# EAGLE design mother3 (EAGLE 8.3.1)
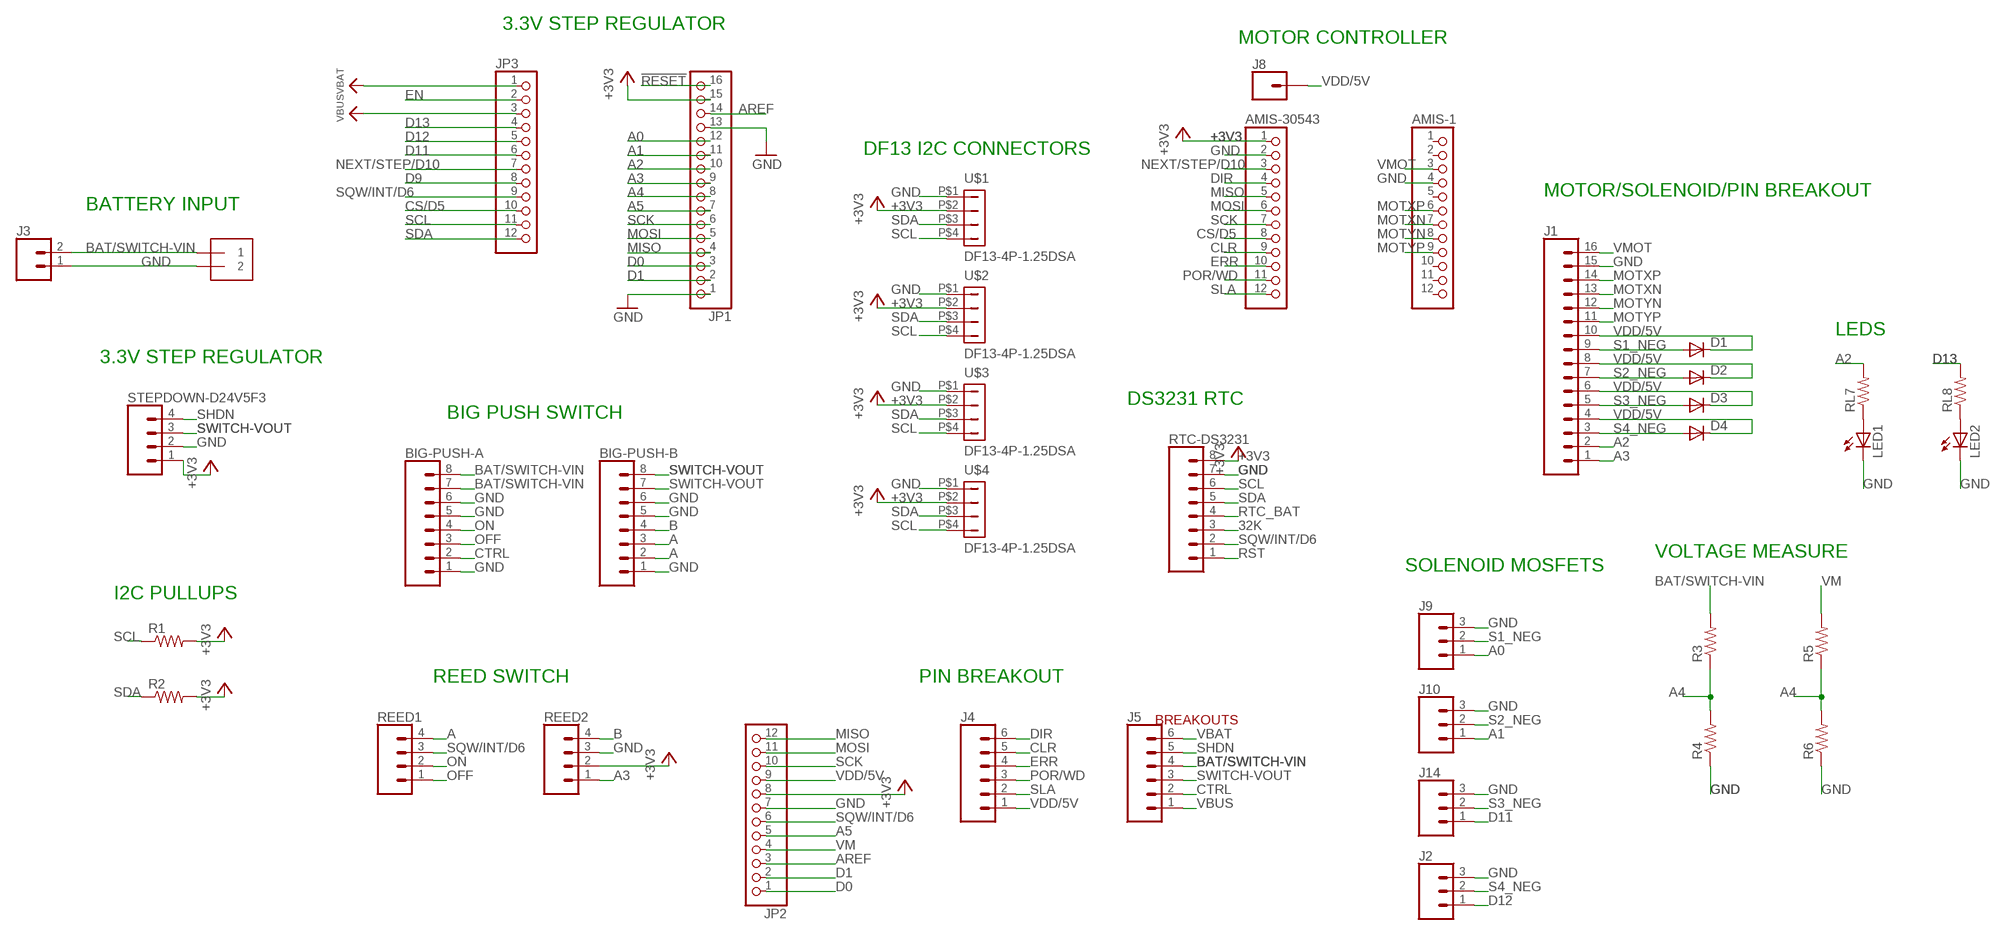
[diagram p0: schematic, sheet 1]

## Parts
AMIS-1  PINHD-1X12-CB  [1X12-CB]
AMIS-30543  PINHD-1X12-CB  [1X12-CB]
BAT  1X2-3.5MM  [1X2-3.5MM]
BIG-PUSH-A  CONN_08"  [1X08]
BIG-PUSH-B  CONN_08"  [1X08]
D1  1N4148DO35-7  [DO35-7]
D2  1N4148DO35-7  [DO35-7]
D3  1N4148DO35-7  [DO35-7]
D4  1N4148DO35-7  [DO35-7]
J1  CONN_16  [1X16]
J2  CONN_03  [1X03]
J3  CONN_02  [1X02]
J4  CONN_06SILK_FEMALE_PTH  [1X06]
J5  CONN_06SILK_FEMALE_PTH  [1X06]
J8  CONN_01  [1X01]
J9  CONN_03  [1X03]
J10  CONN_03  [1X03]
J14  CONN_03  [1X03]
JP1  HEADER-1X16ROUND  [1X16_ROUND]
JP2  HEADER-1X12  [1X12_ROUND]
JP3  HEADER-1X12  [1X12_ROUND]
LED1  LED5MM  [LED5MM]
LED2  LED5MM  [LED5MM]
R1  R-US_0207/10  [0207/10]
R2  R-US_0207/10  [0207/10]
R3  R-US_0207/10  [0207/10]
R4  R-US_0207/10  [0207/10]
R5  R-US_0207/10  [0207/10]
R6  R-US_0207/10  [0207/10]
REED1  CONN_04  [1X04]
REED2  CONN_04  [1X04]
RL7  R-US_0207/10  [0207/10]
RL8  R-US_0207/10  [0207/10]
RTC-DS3231  CONN_08"  [1X08]
STEPDOWN-D24V5F3  CONN_04  [1X04]
U$1  DF13-4P-1.25DSA  [DF13-4P-1.25DSA]
U$2  DF13-4P-1.25DSA  [DF13-4P-1.25DSA]
U$3  DF13-4P-1.25DSA  [DF13-4P-1.25DSA]
U$4  DF13-4P-1.25DSA  [DF13-4P-1.25DSA]

## Nets
32K: RTC-DS3231.3
!RESET: JP1.16
+3V3: AMIS-30543.1 JP1.15 JP2.8 R1.2 R2.2 REED2.2 RTC-DS3231.8 STEPDOWN-D24V5F3.1 U$1.P$2 U$2.P$2 U$3.P$2 U$4.P$2
A: BIG-PUSH-B.2 BIG-PUSH-B.3 REED1.4
A0: J9.1 JP1.12
A1: J10.1 JP1.11
A2: J1.2 JP1.10 RL7.2
A3: J1.1 JP1.9 REED2.1
A4: JP1.8 R3.1 R4.2 R5.1 R6.2
A5: JP1.7 JP2.5
AREF: JP1.14 JP2.3
B: BIG-PUSH-B.4 REED2.4
BAT/SWITCH-VIN: BAT.1 BIG-PUSH-A.7 BIG-PUSH-A.8 J3.2 J5.4 R3.2
CLR: AMIS-30543.9 J4.5
CS/D5: AMIS-30543.8 JP3.10
CTRL: BIG-PUSH-A.2 J5.2
D0: JP1.3 JP2.1
D1: JP1.2 JP2.2
D9: JP3.8
D11: J14.1 JP3.6
D12: J2.1 JP3.5
D13: JP3.4 RL8.2
DIR: AMIS-30543.4 J4.6
EN: JP3.2
ERR: AMIS-30543.10 J4.4
GND: AMIS-1.4 AMIS-30543.2 BAT.2 BIG-PUSH-A.1 BIG-PUSH-A.5 BIG-PUSH-A.6 BIG-PUSH-B.1 BIG-PUSH-B.5 BIG-PUSH-B.6 J1.15 J2.3 J3.1 J9.3 J10.3 J14.3 JP1.1 JP1.13 JP2.7 LED1.K(C) LED2.K(C) R4.1 R6.1 REED2.3 RTC-DS3231.7 STEPDOWN-D24V5F3.2 U$1.P$1 U$2.P$1 U$3.P$1 U$4.P$1
MISO: AMIS-30543.5 JP1.4 JP2.12
MOSI: AMIS-30543.6 JP1.5 JP2.11
MOTXN: AMIS-1.7 J1.13
MOTXP: AMIS-1.6 J1.14
MOTYN: AMIS-1.8 J1.12
MOTYP: AMIS-1.9 J1.11
N$1: LED1.A RL7.1
N$2: LED2.A RL8.1
NEXT/STEP/D10: AMIS-30543.3 JP3.7
OFF: BIG-PUSH-A.3 REED1.1
ON: BIG-PUSH-A.4 REED1.2
POR/WD: AMIS-30543.11 J4.3
RST: RTC-DS3231.1
RTC_BAT: RTC-DS3231.4
S1_NEG: D1.A J1.9 J9.2
S2_NEG: D2.A J1.7 J10.2
S3_NEG: D3.A J1.5 J14.2
S4_NEG: D4.A J1.3 J2.2
SCK: AMIS-30543.7 JP1.6 JP2.10
SCL: JP3.11 R1.1 RTC-DS3231.6 U$1.P$4 U$2.P$4 U$3.P$4 U$4.P$4
SDA: JP3.12 R2.1 RTC-DS3231.5 U$1.P$3 U$2.P$3 U$3.P$3 U$4.P$3
SHDN: J5.5 STEPDOWN-D24V5F3.4
SLA: AMIS-30543.12 J4.2
SQW/INT/D6: JP2.6 JP3.9 REED1.3 RTC-DS3231.2
SWITCH-VOUT: BIG-PUSH-B.7 BIG-PUSH-B.8 J5.3 STEPDOWN-D24V5F3.3
VBAT: J5.6 JP3.1
VBUS: J5.1 JP3.3
VDD/5V: D1.C D2.C D3.C D4.C J1.4 J1.6 J1.8 J1.10 J4.1 J8.1 JP2.9
VM: JP2.4 R5.2
VMOT: AMIS-1.3 J1.16
Unconnected: AMIS-1.1 AMIS-1.2 AMIS-1.5 AMIS-1.10 AMIS-1.11 AMIS-1.12

## Notes on the sheet
- 3.3V STEP REGULATOR
- MOTOR CONTROLLER
- DF13 I2C CONNECTORS
- MOTOR/SOLENOID/PIN BREAKOUT
- BATTERY INPUT
- LEDS
- 3.3V STEP REGULATOR
- DS3231 RTC
- BIG PUSH SWITCH
- VOLTAGE MEASURE
- SOLENOID MOSFETS
- I2C PULLUPS
- REED SWITCH | PIN BREAKOUT
- BREAKOUTS

## Library data of the parts
AMIS-1 AMIS-30543 = adafruit:PINHD-1X12: PIN HEADER
BAT = adafruit:1X2: 3.5mm Terminal block http://www.ladyada.net/library/pcb/eaglelibrary.html
BIG-PUSH-A BIG-PUSH-B RTC-DS3231 = SparkFun-Connectors:CONN_08: Multi connection point. Often used as Generic Header-pin footprint for 0.1 inch spaced/style header connections On any of the 0.1 inch spaced packages, you can populate with these: Break Away Headers - Straight <https://www.sparkfun.com/products/116> (PRT-00116) Break Away Male Headers - Right Angle <https://www.sparkfun.com/products/553> (PRT-00553) Female Headers <https://www.sparkfun.com/products/115> (PRT-00115) Break Away Headers - Machine Pin <https://www.sparkfun.com/products/117> (PRT-00117) Break Away Female Headers - Swiss Machine Pin <https://www.sparkfun.com/products/743> (PRT-00743) Arduino Stackable Header - 8 Pin <https://www.sparkfun.com/products/9279> (PRT-09279) For SCREWTERMINALS and SPRING TERMINALS visit here: Screw Terimnals on SparkFun.com <https://www.sparkfun.com/search/results?term=Screw+Terminals> (5mm/3.5mm/2.54mm spacing) This device is also useful as a general connection point to wire up your design to another part of your project. Our various solder wires solder well into these plated through hole pads. Hook-Up Wire - Assortment (Stranded, 22 AWG) <https://www.sparkfun.com/products/11375> (PRT-11375) Hook-Up Wire - Assortment (Solid Core, 22 AWG) <https://www.sparkfun.com/products/11367> (PRT-11367) View the entire wire category on our website here <https://www.sparkfun.com/categories/141> Special notes: Molex polarized connector foot print use with SKU : PRT-08231 with associated crimp pins and housings. 1MM SMD Version SKU: PRT-10208 NOTES ON THE VARIANTS LOCK and LOCK_LONGPADS... This footprint was designed to help hold the alignment of a through-hole component (i.e. 6-pin header) while soldering it into place. You may notice that each hole has been shifted either up or down by 0.005 of an inch from it's more standard position (which is a perfectly straight line). This slight alteration caused the pins (the squares in the middle) to touch the edges of the holes. Because they are alternating, it causes a "brace" to hold the component in place. 0.005 has proven to be the perfect amount of "off-center" position when using our standard breakaway headers. Although looks a little odd when you look at the bare footprint, once you have a header in there, the alteration is very hard to notice. Also,if you push a header all the way into place, it is covered up entirely on the bottom side.; PROD_ID: CONN-08438
D1-D4 = diode:1N4148: DIODE high speed (Philips)
J1 = SparkFun-Connectors:CONN_16: Multi connection point. Often used as Generic Header-pin footprint for 0.1 inch spaced/style header connections On any of the 0.1 inch spaced packages, you can populate with these: Break Away Headers - Straight <https://www.sparkfun.com/products/116> (PRT-00116) Break Away Male Headers - Right Angle <https://www.sparkfun.com/products/553> (PRT-00553) Female Headers <https://www.sparkfun.com/products/115> (PRT-00115) Break Away Headers - Machine Pin <https://www.sparkfun.com/products/117> (PRT-00117) Break Away Female Headers - Swiss Machine Pin <https://www.sparkfun.com/products/743> (PRT-00743) For SCREWTERMINALS and SPRING TERMINALS visit here: Screw Terimnals on SparkFun.com <https://www.sparkfun.com/search/results?term=Screw+Terminals> (5mm/3.5mm/2.54mm spacing) This device is also useful as a general connection point to wire up your design to another part of your project. Our various solder wires solder well into these plated through hole pads. Hook-Up Wire - Assortment (Stranded, 22 AWG) <https://www.sparkfun.com/products/11375> (PRT-11375) Hook-Up Wire - Assortment (Solid Core, 22 AWG) <https://www.sparkfun.com/products/11367> (PRT-11367) View the entire wire category on our website here <https://www.sparkfun.com/categories/141> Special notes: Molex polarized connector foot print use with SKU : PRT-08231 with associated crimp pins and housings. 1MM SMD Version SKU: PRT-10208 NOTES ON THE VARIANTS LOCK and LOCK_LONGPADS... This footprint was designed to help hold the alignment of a through-hole component (i.e. 6-pin header) while soldering it into place. You may notice that each hole has been shifted either up or down by 0.005 of an inch from it's more standard position (which is a perfectly straight line). This slight alteration caused the pins (the squares in the middle) to touch the edges of the holes. Because they are alternating, it causes a "brace" to hold the component in place. 0.005 has proven to be the perfect amount of "off-center" position when using our standard breakaway headers. Although looks a little odd when you look at the bare footprint, once you have a header in there, the alteration is very hard to notice. Also,if you push a header all the way into place, it is covered up entirely on the bottom side.
J2 J9 J10 J14 = SparkFun-Connectors:CONN_03: Multi connection point. Often used as Generic Header-pin footprint for 0.1 inch spaced/style header connections On any of the 0.1 inch spaced packages, you can populate with these: Break Away Headers - Straight <https://www.sparkfun.com/products/116> (PRT-00116) Break Away Male Headers - Right Angle <https://www.sparkfun.com/products/553> (PRT-00553) Female Headers <https://www.sparkfun.com/products/115> (PRT-00115) Break Away Headers - Machine Pin <https://www.sparkfun.com/products/117> (PRT-00117) Break Away Female Headers - Swiss Machine Pin <https://www.sparkfun.com/products/743> (PRT-00743) Stackable Header - 3 Pin (Female, 0.1") <https://www.sparkfun.com/products/13875> (PRT-13875) For SCREWTERMINALS and SPRING TERMINALS visit here: Screw Terimnals on SparkFun.com <https://www.sparkfun.com/search/results?term=Screw+Terminals> (5mm/3.5mm/2.54mm spacing) This device is also useful as a general connection point to wire up your design to another part of your project. Our various solder wires solder well into these plated through hole pads. Hook-Up Wire - Assortment (Stranded, 22 AWG) <https://www.sparkfun.com/products/11375> (PRT-11375) Hook-Up Wire - Assortment (Solid Core, 22 AWG) <https://www.sparkfun.com/products/11367> (PRT-11367) View the entire wire category on our website here <https://www.sparkfun.com/categories/141> Special notes: Molex polarized connector foot print use with SKU : PRT-08232 with associated crimp pins and housings.
J3 = SparkFun-Connectors:CONN_02: Multi connection point. Often used as Generic Header-pin footprint for 0.1 inch spaced/style header connections On any of the 0.1 inch spaced packages, you can populate with these: Break Away Headers - Straight <https://www.sparkfun.com/products/116> (PRT-00116) Break Away Male Headers - Right Angle <https://www.sparkfun.com/products/553> (PRT-00553) Female Headers <https://www.sparkfun.com/products/115> (PRT-00115) Break Away Headers - Machine Pin <https://www.sparkfun.com/products/117> (PRT-00117) Break Away Female Headers - Swiss Machine Pin <https://www.sparkfun.com/products/743> (PRT-00743) For SCREWTERMINALS and SPRING TERMINALS visit here: Screw Terimnals on SparkFun.com <https://www.sparkfun.com/search/results?term=Screw+Terminals> (5mm/3.5mm/2.54mm spacing) This device is also useful as a general connection point to wire up your design to another part of your project. Our various solder wires solder well into these plated through hole pads. Hook-Up Wire - Assortment (Stranded, 22 AWG) <https://www.sparkfun.com/products/11375> (PRT-11375) Hook-Up Wire - Assortment (Solid Core, 22 AWG) <https://www.sparkfun.com/products/11367> (PRT-11367) View the entire wire category on our website here <https://www.sparkfun.com/categories/141> Special notes: Molex polarized connector foot print use with: PRT-08233 with associated crimp pins and housings. 2.54_SCREWTERM for use with PRT-10571. 3.5mm Screw Terminal footprints for PRT-08084 5mm Screw Terminal footprints for use with PRT-08432
J4 J5 = SparkFun-Connectors:CONN_06: Multi connection point. Often used as Generic Header-pin footprint for 0.1 inch spaced/style header connections On any of the 0.1 inch spaced packages, you can populate with these: Break Away Headers - Straight <https://www.sparkfun.com/products/116> (PRT-00116) Break Away Male Headers - Right Angle <https://www.sparkfun.com/products/553> (PRT-00553) Female Headers <https://www.sparkfun.com/products/115> (PRT-00115) Break Away Headers - Machine Pin <https://www.sparkfun.com/products/117> (PRT-00117) Break Away Female Headers - Swiss Machine Pin <https://www.sparkfun.com/products/743> (PRT-00743) Arduino Stackable Header - 6 Pin <https://www.sparkfun.com/products/9280> (PRT-09280) For SCREWTERMINALS and SPRING TERMINALS visit here: Screw Terimnals on SparkFun.com <https://www.sparkfun.com/search/results?term=Screw+Terminals> (5mm/3.5mm/2.54mm spacing) This device is also useful as a general connection point to wire up your design to another part of your project. Our various solder wires solder well into these plated through hole pads. Hook-Up Wire - Assortment (Stranded, 22 AWG) <https://www.sparkfun.com/products/11375> (PRT-11375) Hook-Up Wire - Assortment (Solid Core, 22 AWG) <https://www.sparkfun.com/products/11367> (PRT-11367) View the entire wire category on our website here <https://www.sparkfun.com/categories/141>; PROD_ID: CONN-08437
J8 = SparkFun-Connectors:CONN_01: Single connection point. Often used as Generic Header-pin footprint for 0.1 inch spaced/style header connections On any of the 0.1 inch spaced packages, you can populate with these: Break Away Headers - Straight <https://www.sparkfun.com/products/116> (PRT-00116) Break Away Male Headers - Right Angle <https://www.sparkfun.com/products/553> (PRT-00553) Female Headers <https://www.sparkfun.com/products/115> (PRT-00115) Break Away Headers - Machine Pin <https://www.sparkfun.com/products/117> (PRT-00117) Break Away Female Headers - Swiss Machine Pin <https://www.sparkfun.com/products/743> (PRT-00743) This device is also useful as a general connection point to wire up your design to another part of your project. Our various solder wires solder well into these plated through hole pads. Hook-Up Wire - Assortment (Stranded, 22 AWG) <https://www.sparkfun.com/products/11375> (PRT-11375) Hook-Up Wire - Assortment (Solid Core, 22 AWG) <https://www.sparkfun.com/products/11367> (PRT-11367) View the entire wire category on our website here <https://www.sparkfun.com/categories/141> Special notes: SMTSO-256-ET is a "flush mount" nut for a 4-40 screw. We mostly use this on specialty testbeds; it is a nice way to connect hardware to your PCB at an adjustable hieght. Also note, the SNAP packages are for using a snappable style connector. We sell a baggie of snaps and they are also used on two LilyPad designs: Snap Assortment - 30 pack (male and female) <https://www.sparkfun.com/products/11347> (DEV-11347) LilyPad Arduino SimpleSnap <https://www.sparkfun.com/products/10941> (DEV-10941) LilyPad SimpleSnap Protoboard <https://www.sparkfun.com/products/10940> (DEV-10940)
JP1 = microbuilder:HEADER-1X16: PIN HEADER
JP2 JP3 = microbuilder:HEADER-1X12
LED1 LED2 = adafruit:LED: LED OSRAM: - CHIPLED LG R971, LG N971, LY N971, LG Q971, LY Q971, LO R971, LY R971 LH N974, LH R974 LS Q976, LO Q976, LY Q976 LO Q996 - Hyper CHIPLED LW Q18S LB Q993, LB Q99A, LB R99A - SideLED LS A670, LO A670, LY A670, LG A670, LP A670 LB A673, LV A673, LT A673, LW A673 LH A674 LY A675 LS A676, LA A676, LO A676, LY A676, LW A676 LS A679, LY A679, LG A679 - Hyper Micro SIDELED® LS Y876, LA Y876, LO Y876, LY Y876 LT Y87S - SmartLED LW L88C, LW L88S LB L89C, LB L89S, LG L890 LS L89K, LO L89K, LY L89K LS L896, LA L896, LO L896, LY L896 - TOPLED LS T670, LO T670, LY T670, LG T670, LP T670 LSG T670, LSP T670, LSY T670, LOP T670, LYG T670 LG T671, LOG T671, LSG T671 LB T673, LV T673, LT T673, LW T673 LH T674 LS T676, LA T676, LO T676, LY T676, LB T676, LH T676, LSB T676, LW T676 LB T67C, LV T67C, LT T67C, LS T67K, LO T67K, LY T67K, LW E67C LS E67B, LA E67B, LO E67B, LY E67B, LB E67C, LV E67C, LT E67C LW T67C LS T679, LY T679, LG T679 LS T770, LO T770, LY T770, LG T770, LP T770 LB T773, LV T773, LT T773, LW T773 LH T774 LS E675, LA E675, LY E675, LS T675 LS T776, LA T776, LO T776, LY T776, LB T776 LHGB T686 LT T68C, LB T68C - Hyper Mini TOPLED® LB M676 - Mini TOPLED Santana® LG M470 LS M47K, LO M47K, LY M47K Source: http://www.osram.convergy.de/
R1-R6 RL7 RL8 = adafruit:R-US_: RESISTOR, American symbol
REED1 REED2 STEPDOWN-D24V5F3 = SparkFun-Connectors:CONN_04: Multi connection point. Often used as Generic Header-pin footprint for 0.1 inch spaced/style header connections On any of the 0.1 inch spaced packages, you can populate with these: Break Away Headers - Straight <https://www.sparkfun.com/products/116> (PRT-00116) Break Away Male Headers - Right Angle <https://www.sparkfun.com/products/553> (PRT-00553) Female Headers <https://www.sparkfun.com/products/115> (PRT-00115) Break Away Headers - Machine Pin <https://www.sparkfun.com/products/117> (PRT-00117) Break Away Female Headers - Swiss Machine Pin <https://www.sparkfun.com/products/743> (PRT-00743) For SCREWTERMINALS and SPRING TERMINALS visit here: Screw Terimnals on SparkFun.com <https://www.sparkfun.com/search/results?term=Screw+Terminals> (5mm/3.5mm/2.54mm spacing) This device is also useful as a general connection point to wire up your design to another part of your project. Our various solder wires solder well into these plated through hole pads. Hook-Up Wire - Assortment (Stranded, 22 AWG) <https://www.sparkfun.com/products/11375> (PRT-11375) Hook-Up Wire - Assortment (Solid Core, 22 AWG) <https://www.sparkfun.com/products/11367> (PRT-11367) View the entire wire category on our website here <https://www.sparkfun.com/categories/141> Special notes: Molex polarized connector foot print use with SKU : PRT-08231 with associated crimp pins and housings. 1MM SMD Version SKU: PRT-10208; PROD_ID: CONN-09696
U$1-U$4 = con-hirose-df13:DF13-4P-1.25: DF13-4P 1.25mm Pitch Miniature Crimping Connector.

## Board
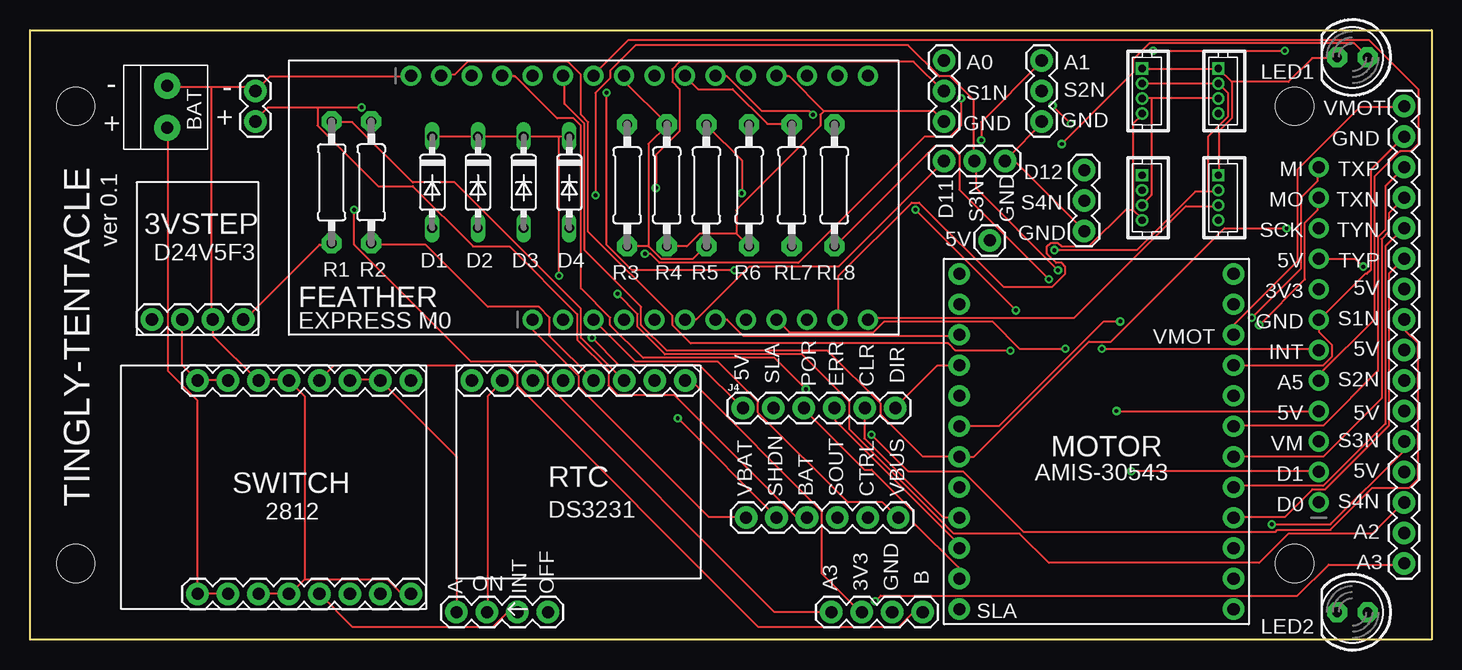
[diagram p1: board, top side]
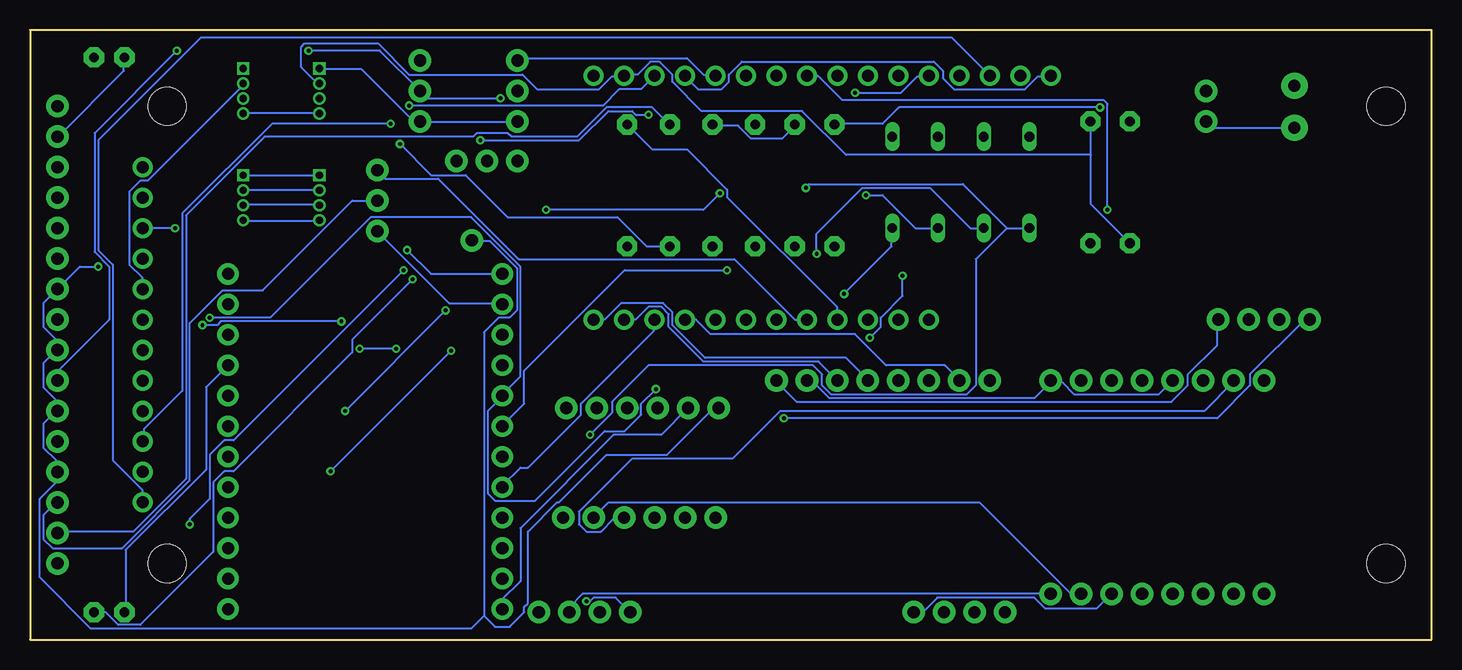
[diagram p2: board, bottom side, seen from below]

Size 116.84 x 50.8 mm. Coordinates in mm from the lower left corner, seen from the top.
Outline: 0,0 0,50.8 116.84,50.8 116.84,0 0,0
Copper layers (1*16): Top 0.0356mm / dielectric 1.5011mm / Bottom 0.0356mm
Design rules "LaenPCBOrder": minimum track width 6mil, minimum drill 13mil, track to track 6mil, track to pad 6mil, pad to pad 6mil, via to via 6mil, smd to smd 6mil, copper to edge 15mil, drill to drill 6mil, minimum pad ring 7mil, minimum via ring 7mil, stop-mask expansion 3mil, vias tented up to drill 0mil, thermal gap 10mil
Holes 3.17 mm at 3.81,44.45 3.81,6.35 105.41,44.45 105.41,6.35

### Footprints (pad centres in the part's own frame; a part is rotated, then mirrored left to right if it is on the bottom)
1X12-CB = drill 1.016 pad 1.778: 1 -13.97,0; 2 -11.43,0; 3 -8.89,0; 4 -6.35,0; 5 -3.81,0; 6 -1.27,0; 7 1.27,0; 8 3.81,0; 9 6.35,0; 10 8.89,0; 11 11.43,0; 12 13.97,0
1X2-3.5MM = drill 1 pad 2.184: 1 1.8,0; 2 -1.7,0
1X08 = drill 1.016 pad 1.88: 1 0,0; 2 2.54,0; 3 5.08,0; 4 7.62,0; 5 10.16,0; 6 12.7,0; 7 15.24,0; 8 17.78,0
DO35-7 = drill 0.813 long: A 3.81,0; C -3.81,0
1X16 = drill 1.016 pad 1.88: 1 0,0; 2 2.54,0; 3 5.08,0; 4 7.62,0; 5 10.16,0; 6 12.7,0; 7 15.24,0; 8 17.78,0; 9 20.32,0; 10 22.86,0; 11 25.4,0; 12 27.94,0; 13 30.48,0; 14 33.02,0; 15 35.56,0; 16 38.1,0
1X03 = drill 1.016 pad 1.88: 1 0,0; 2 2.54,0; 3 5.08,0
1X02 = drill 1.016 pad 1.88: 1 0,0; 2 2.54,0
1X06 = drill 1.016 pad 1.88: 1 0,0; 2 2.54,0; 3 5.08,0; 4 7.62,0; 5 10.16,0; 6 12.7,0
1X01 = drill 1.016 pad 1.88: 1 0,0
1X16_ROUND = drill 1 pad 1.676: 1 -19.05,0; 2 -16.51,0; 3 -13.97,0; 4 -11.43,0; 5 -8.89,0; 6 -6.35,0; 7 -3.81,0; 8 -1.27,0; 9 1.27,0; 10 3.81,0; 11 6.35,0; 12 8.89,0; 13 11.43,0; 14 13.97,0; 15 16.51,0; 16 19.05,0
1X12_ROUND = drill 1 pad 1.676: 1 -13.97,0; 2 -11.43,0; 3 -8.89,0; 4 -6.35,0; 5 -3.81,0; 6 -1.27,0; 7 1.27,0; 8 3.81,0; 9 6.35,0; 10 8.89,0; 11 11.43,0; 12 13.97,0
LED5MM = drill 0.813 pad 1.676 octagon: A -1.27,0; K 1.27,0
0207/10 = drill 0.813 pad 1.676 octagon: 1 -5.08,0; 2 5.08,0
1X04 = drill 1.016 pad 1.88: 1 0,0; 2 2.54,0; 3 5.08,0; 4 7.62,0
DF13-4P-1.25DSA = drill 0.6 pad 1.016 square: P$1 1.875,0 | drill 0.6 pad 1.016: P$2 0.625,0; P$3 -0.625,0; P$4 -1.875,0

### Placement (x,y rotation side)
AMIS-1  100.33,16.51 270 top
AMIS-30543  77.47,16.51 270 top
BAT  11.43,44.45 270 top
BIG-PUSH-A  31.75,3.81 180 top
BIG-PUSH-B  31.75,21.59 180 top
D1  33.53,38.1 270 top
D2  37.34,38.1 270 top
D3  41.15,38.1 270 top
D4  44.96,38.1 270 top
J1  114.55,6.35 90 top
J2  87.88,39.12 270 top
J3  18.8,45.72 270 top
J4  59.44,19.3 0 top
J5  72.39,10.16 180 top
J8  80.01,33.27 0 top
J9  76.2,48.26 270 top
J10  84.33,48.26 270 top
J14  76.2,39.88 0 top
JP1  50.8,46.99 0 top
JP2  107.44,25.4 90 top
JP3  55.88,26.67 0 top
LED1  110.24,48.51 180 top
LED2  110.24,2.29 180 top
R1  25.15,38.1 270 top
R2  28.45,38.1 90 top
R3  49.78,37.85 90 top
R4  53.09,37.85 90 top
R5  56.39,37.85 90 top
R6  59.94,37.85 90 top
REED1  43.18,2.29 180 top
REED2  66.8,2.29 0 top
RL7  63.5,37.85 90 top
RL8  67.06,37.85 90 top
RTC-DS3231  36.83,21.59 0 top
STEPDOWN-D24V5F3  17.78,26.67 180 top
U$1  92.71,36.83 90 top
U$2  92.71,45.72 90 top
U$3  99.06,36.83 90 top
U$4  99.06,45.72 90 top

### Tracks (layer width: path | path; a pad name or v marks a point on that pad's centre or on a via)
+3V3  (via drill 0.33)
  Top 0.152: v85.39,32.46 92.25,32.46 97.13,37.34 98.2,37.34 | 98.2,37.34 98.96,37.34 U$3.P$2 | U$2.P$2 98.96,46.33 U$4.P$2 99.11,46.33 99.87,45.57 99.87,43.59 98.2,41.91 98.2,37.34 | R1.2 25.04,32.92 24.13,32.92 17.88,26.67 STEPDOWN-D24V5F3.1 | RTC-DS3231.8 54.61,21.49 55.22,21.49 66.04,10.67 66.04,5.49 69.24,2.29 REED2.2
  Bottom 0.152: U$1.P$2 92.71,37.49 98.96,37.49 U$3.P$2 | AMIS-30543.1 83.41,30.48 v85.39,32.46 | U$2.P$2 92.71,46.48 93.02,46.48 94.23,47.7 94.23,49.38 93.93,49.68 87.83,49.68 85.24,47.09 75.79,47.09 74.57,45.87 69.39,45.87 68.33,46.94 67.41,46.94 JP1.15 67.26,47.09 66.19,47.09 65.13,48.16 64.36,48.16 63.3,47.09 63.3,46.48 60.86,44.04 52.48,44.04 48.82,40.39 28.4,40.39 | JP2.8 107.49,29.26 107.49,30.18 108.56,31.24 108.56,37.34 107.64,38.25 107.04,38.25 98.96,46.33 U$4.P$2 | 28.4,40.39 28.4,36.27 R1.2 | 28.4,40.39 28.4,43.13 R2.2 | STEPDOWN-D24V5F3.1 17.88,26.67 17.88,24.54 20.32,22.1 20.32,21.18 21.69,19.81 52.93,19.81 54.61,21.49 RTC-DS3231.8
A
  Top 0.152: BIG-PUSH-B.3 26.72,21.64 29.16,21.64 BIG-PUSH-B.2 35.56,15.24 REED1.4
A0
  Bottom 0.152: JP1.12 59.79,47.09 60.71,47.09 62.08,48.46 75.95,48.46 76.1,48.31 J9.1
A1  (via drill 0.33)
  Top 0.152: v65.28,43.74 64.97,44.04 61.01,44.04 58.12,46.94 57.2,46.94 JP1.11 | v79.3,41.6 79.3,43.13 84.33,48.16 J10.1
  Bottom 0.152: v65.28,43.74 66.34,43.74 66.65,44.04 68.63,44.04 71.07,41.6 v79.3,41.6
A2
  Top 0.152: RL7.2 63.45,42.98 61.47,42.98 58.57,45.87 55.68,45.87 54.61,46.94 JP1.10
  Bottom 0.152: J1.2 114.5,8.99 108.25,8.99 103.83,13.41 103.83,35.36 97.28,41.91 79.91,41.91 79.6,42.22 77.01,42.22 76.71,41.91 71.22,41.91 68.78,44.35 64.97,44.35 63.6,42.98 RL7.2
A3  (via drill 0.33)
  Top 0.152: v27.03,35.81 27.03,32.92 36.78,23.16 42.11,23.16 43.18,22.1 43.18,21.18 62.08,2.29 REED2.1 | v70.46,3.2 70.92,3.66 105.66,3.66 108.25,6.25 114.5,6.25 J1.1
  Bottom 0.152: v27.03,35.81 27.03,44.65 27.33,44.96 49.12,44.96 51.11,46.94 52.02,46.94 JP1.9 | v70.46,3.2 70.16,3.2 69.85,3.5 68.02,3.5 REED2.1
A4
  Top 0.152: 51.56,32.77 R3.1 | 51.56,32.77 52.63,31.7 55.22,31.7 56.29,32.77 R5.1 | JP1.8 49.58,46.94 49.58,46.48 53.09,42.98 R4.2 53.09,42.82 51.56,41.3 51.56,32.77
  Bottom 0.152: R6.2 59.94,42.82 57.81,42.82 56.74,41.76 54.15,41.76 53.09,42.82 R4.2
A5
  Top 0.152: JP2.5 107.49,21.64 107.49,22.1 112.06,26.67 112.06,38.56 114.2,40.69 115.11,40.69 115.72,41.3 115.72,45.87 111.61,49.99 49.89,49.99 46.99,47.09 JP1.7
AREF  (via drill 0.33)
  Top 0.152: v85.24,44.5 v86.77,42.98
  Bottom 0.152: v86.77,42.98 96.67,42.98 104.14,35.51 104.14,20.73 107.34,17.53 107.34,16.61 JP2.3 | v85.24,44.5 69.09,44.5 67.72,45.87 65.89,45.87 JP1.14
B
  Top 0.152: REED2.4 73.66,2.29 72.44,1.07 60.71,1.07 40.59,21.18 40.59,22.1 39.83,22.86 25.35,22.86 24.13,21.64 BIG-PUSH-B.4
BAT/SWITCH-VIN  (via drill 0.33)
  Top 0.152: BIG-PUSH-A.7 BIG-PUSH-A.8 13.92,3.81 13.92,19.96 11.48,22.4 11.48,42.52 BAT.1 | 23.98,44.35 19.86,44.35 18.8,43.28 J3.2 | 23.98,44.35 v27.63,44.35 | 23.98,44.35 23.98,42.82 29.01,37.8 31.9,37.8 36.93,32.77 39.98,32.77 45.62,27.13 45.62,24.99 48.21,22.4 48.21,21.18 48.97,20.42 53.7,20.42 63.91,10.21 64.67,10.21 J5.4
  Bottom 0.152: v27.63,44.35 44.4,44.35 45.77,42.98 49.73,42.98 R3.2 | BAT.1 11.48,42.67 18.34,42.67 18.8,43.13 J3.2
CLR
  Top 0.152: AMIS-30543.9 77.47,10.21 76.1,10.21 69.55,16.76 69.55,19.2 J4.5
CS/D5
  Bottom 0.152: JP3.10 64.82,26.67 64.82,25.76 70.92,19.66 70.92,18.75 75.34,14.33 75.95,14.33 77.47,12.8 AMIS-30543.8
CTRL
  Bottom 0.152: BIG-PUSH-A.2 30.07,3.81 37.69,11.43 68.63,11.43 69.85,10.21 J5.2
D0
  Bottom 0.152: JP1.3 39.98,50.14 102.62,50.14 111.15,41.6 111.15,32.46 109.93,31.24 109.93,14.94 107.49,12.5 107.49,11.43 JP2.1
D1  (via drill 0.33)
  Top 0.152: v81.74,24.08 77.16,24.08 76.56,24.69 55.07,24.69 53.54,26.21 53.54,26.98 46.53,33.98 46.53,43.13 45.92,43.74 45.92,47.09 44.86,48.16 36.47,48.16 35.41,47.09 34.34,47.09 JP1.2 | v91.8,14.02 107.34,14.02 JP2.2
  Bottom 0.152: v91.8,14.02 v81.74,24.08
D11
  Top 0.152: JP3.6 55.52,26.67 59.94,31.09 67.41,31.09 J14.1
D12
  Bottom 0.152: JP3.5 53.09,26.67 58.12,31.7 76.1,31.7 82.8,38.41 87.22,38.41 87.83,39.01 J2.1
D13
  Bottom 0.152: RL8.2 64.97,40.84 62.08,40.84 58.73,37.49 58.73,36.88 49.58,27.74 49.58,26.67 JP3.4
DIR
  Top 0.152: AMIS-30543.4 75.64,22.86 72.14,19.36 J4.6
ERR
  Top 0.152: AMIS-30543.10 77.47,7.92 67.11,18.29 67.11,19.2 J4.4
GND
  Top 0.152: BIG-PUSH-A.6 BIG-PUSH-A.5 21.69,3.81 22.91,5.03 | BIG-PUSH-A.1 30.99,3.81 29.77,5.03 22.91,5.03 | JP1.1 31.75,46.94 20.02,46.94 J3.1 18.49,46.02 15.14,46.02 | 15.14,46.02 11.48,46.02 BAT.2 | 15.14,46.02 15.14,26.67 STEPDOWN-D24V5F3.2 15.29,26.67 15.29,25.3 18.95,21.64 BIG-PUSH-B.6 19.1,21.64 21.54,21.64 BIG-PUSH-B.5 22.91,20.27 22.91,5.03 | 107.49,26.67 107.49,25.6 108.56,24.54 108.56,23.62 107.8,22.86 AMIS-1.4 | U$2.P$1 92.71,47.55 98.96,47.55 U$4.P$1 99.11,47.55 100.18,46.48 | 100.18,46.48 100.18,43.43 99.11,42.37 99.11,38.71 U$3.P$1 | 100.18,46.48 104.9,46.48 106.88,48.46 108.86,48.46 LED1.K | 81.58,40.23 84.33,42.98 J10.3 | 81.58,40.23 81.28,39.93 J14.3 81.58,40.23 | R4.1 54.76,32.77 55.83,33.83 58.88,33.83 | R6.1 58.88,33.83 | 66.19,44.04 63.3,46.94 62.23,46.94 JP1.13 | 66.19,44.04 75.34,44.04 J9.3 | 58.88,33.83 58.88,35.81 65.89,42.82 65.89,43.74 66.19,44.04 | 81.58,40.23 81.74,40.23 87.83,34.14 J2.3 | 107.49,26.67 111.3,30.48 111.45,30.48 111.76,30.79 111.76,39.17 114.5,41.91 J1.15 | 107.49,26.67 JP2.7
  Bottom 0.152: BIG-PUSH-A.1 70.76,3.81 71.83,2.74 71.83,2.29 REED2.3 | 31.75,21.49 30.84,21.49 29.77,20.42 22.76,20.42 BIG-PUSH-B.5 | 31.75,21.49 33.12,20.12 50.19,20.12 51.56,21.49 52.02,21.49 RTC-DS3231.7 | 31.75,21.49 BIG-PUSH-B.1 | AMIS-1.4 102.16,21.03 102.16,14.17 108.86,7.47 108.86,2.29 LED2.K | U$1.P$1 98.96,38.71 U$3.P$1 | LED1.K 109.02,48.46 109.02,47.4 114.5,41.91 J1.15 | J2.3 81.89,28.04 77.47,28.04 AMIS-30543.2 | J9.3 76.25,43.13 84.33,43.13 J10.3 84.33,43.28 84.94,43.28 89.2,47.55 92.71,47.55 U$2.P$1 | JP1.1 31.75,46.94 32.82,46.94 33.88,45.87 39.83,45.87 40.74,46.79 40.74,47.4 41.5,48.16 57.51,48.16 58.57,47.09 58.57,46.48 59.18,45.87 61.16,45.87 62.23,46.94 JP1.13
MISO  (via drill 0.33)
  Top 0.152: v64.67,20.88 62.08,23.47 51.11,23.47 48.36,26.21 48.36,26.82 45.92,29.26 45.92,42.82 45.31,43.43 43.94,43.43 40.44,46.94 39.37,46.94 JP1.4 | v101.85,26.82 105.97,30.94 105.97,36.88 107.34,38.25 107.34,39.32 JP2.12
  Bottom 0.152: v64.67,20.88 65.89,19.66 65.89,18.75 67.26,17.37 68.94,17.37 74.73,11.58 78.08,11.58 78.69,12.19 78.69,19.05 77.47,20.27 AMIS-30543.5 77.47,20.42 75.95,21.95 75.95,31.09 80.06,35.2 88.44,35.2 96.83,26.82 v101.85,26.82
MOSI  (via drill 0.33)
  Top 0.152: v48.06,45.57 48.06,32.92 50.19,30.79 v58.73,30.79 | v102.46,26.21 106.27,30.02 106.27,34.75 107.34,35.81 107.34,36.73 JP2.11 | v90.88,26.52 89.51,26.52 80.82,17.83 77.47,17.83 AMIS-30543.6
  Bottom 0.152: v48.06,45.57 44.25,45.57 42.88,46.94 41.96,46.94 JP1.5 | v58.73,30.79 67.26,30.79 75.64,22.4 75.64,19.66 77.47,17.83 AMIS-30543.6 | v102.46,26.21 101.24,26.21 100.94,26.52 v90.88,26.52
MOTXN
  Top 0.152: AMIS-1.7 107.8,15.24 112.67,20.12 112.67,33.38 113.28,33.98 113.28,35.51 114.5,36.73 J1.13
MOTXP
  Top 0.152: J1.14 112.98,37.8 112.98,34.14 112.37,33.53 112.37,22.4 107.8,17.83 100.33,17.83 AMIS-1.6
MOTYN
  Top 0.152: AMIS-1.8 100.33,12.8 107.8,12.8 112.98,17.98 112.98,32.77 114.5,34.29 J1.12
MOTYP
  Top 0.152: J1.11 113.28,30.48 113.28,17.83 107.95,12.5 106.88,12.5 104.6,10.21 100.33,10.21 AMIS-1.9
N$1  (via drill 0.33)
  Top 0.152: v86,41.3 91.95,47.24 91.95,48.31 93.32,49.68 110.39,49.68 111.45,48.62 LED1.A
  Bottom 0.152: RL7.1 65.43,32.77 67.87,35.2 77.01,35.2 80.52,38.71 83.41,38.71 v86,41.3
N$2  (via drill 0.33)
  Top 0.152: v84.94,30.02 77.47,37.49 77.47,40.39 76.71,41.15 75.49,41.15 67.11,32.77 RL8.1
  Bottom 0.152: LED2.A 110.54,2.29 109.47,1.22 107.64,1.22 101.55,7.32 101.55,13.11 100.63,14.02 99.87,14.02 89.97,23.93 89.97,24.99 v84.94,30.02
NEXT/STEP/D10
  Top 0.152: JP3.7 58.12,26.67 59.49,25.3 77.47,25.3 AMIS-30543.3
OFF
  Bottom 0.152: REED1.1 42.42,2.29 41.2,3.5 33.12,3.5 32.21,2.59 27.94,2.59 26.72,3.81 BIG-PUSH-A.3
ON
  Top 0.152: REED1.2 39.83,2.29 38.61,1.07 26.87,1.07 BIG-PUSH-A.4
POR/WD
  Top 0.152: AMIS-30543.11 77.47,5.94 73.66,9.75 73.66,10.67 70.16,14.17 69.55,14.17 64.52,19.2 J4.3
S1_NEG  (via drill 0.33)
  Top 0.152: v52.17,37.64 52.17,40.39 54.15,42.37 54.15,45.87 53.54,46.48 53.54,47.55 54.15,48.16 73.66,48.16 76.1,45.72 J9.2 | v70.16,17.07 73.2,14.02 77.77,14.02 82.8,8.99 103.83,8.99 103.99,9.14 108.41,9.14 111.91,12.65 114.96,12.65 115.72,13.41 115.72,24.69 114.66,25.76 114.66,26.67 J1.9
  Bottom 0.152: 35.41,34.29 D1.A | 35.41,34.29 39.07,37.95 51.87,37.95 v52.17,37.64 | v70.16,17.07 68.33,18.9 68.33,19.81 65.28,22.86 51.56,22.86 50.8,22.1 50.8,21.18 50.04,20.42 38.76,20.42 38,21.18 38,31.7 35.41,34.29
S2_NEG  (via drill 0.33)
  Top 0.152: v51.26,32.16 51.71,32.16 52.48,31.39 64.06,31.39 74.57,41.91 76.71,41.91 77.62,42.82 v77.62,45.11 | v93.62,49.07 v104.6,49.07
  Bottom 0.152: D2.A 38.46,34.29 41.81,37.64 47.45,37.64 51.26,33.83 v51.26,32.16 | v77.62,45.11 83.72,45.11 J10.2 87.68,49.07 v93.62,49.07 | v104.6,49.07 111.45,42.22 111.45,32.31 110.24,31.09 110.24,26.67 114.5,22.4 114.5,21.64 J1.7
S3_NEG  (via drill 0.33)
  Top 0.152: v47.14,37.03 47.14,45.57 48.36,46.79 48.36,47.4 50.5,49.53 73.2,49.53 75.79,46.94 76.71,46.94 78.69,44.96 78.69,39.93 J14.2 78.84,39.78 78.84,37.64 v85.7,30.79 | v103.53,9.6 108.41,9.6 114.5,15.7 114.5,16.46 J1.5
  Bottom 0.152: D3.A 43.03,34.29 45.77,37.03 v47.14,37.03 | v103.53,9.6 103.53,10.06 101.85,11.73 101.85,15.39 100.63,16.61 99.87,16.61 v85.7,30.79
S4_NEG  (via drill 0.33)
  Top 0.152: v48.97,28.8 50.65,27.13 50.65,26.06 52.93,23.77 64.36,23.77 68.33,19.81 68.33,17.53 77.01,8.84 82.5,8.84 84.94,6.4 102.46,6.4 104.9,8.84 111.91,8.84 114.5,11.43 J1.3
  Bottom 0.152: v48.97,28.8 45.01,32.77 45.01,34.29 D4.A | J2.2 89.97,36.58 97.43,29.11 100.79,29.11 103.53,26.36 103.53,13.26 109.17,7.62 114.96,7.62 115.72,8.38 115.72,10.36 114.66,11.43 J1.3
SCK  (via drill 0.33)
  Top 0.152: JP1.6 44.55,46.94 44.55,44.65 46.23,42.98 46.23,32.46 50.95,27.74 50.95,26.21 53.09,24.08 66.5,24.08 70.92,19.66 70.92,18.75 74.42,15.24 AMIS-30543.7 78.69,15.24 88.29,24.84 90.12,24.84 99.57,34.29 v104.75,34.29
  Bottom 0.152: v104.75,34.29 JP2.10
SCL
  Top 0.152: 91.95,35.81 92.71,35.05 U$1.P$4 | 91.95,35.81 91.95,42.98 92.71,43.74 U$2.P$4 | R1.1 25.2,43.13 26.87,43.13 31.9,38.1 35.41,38.1 45.92,27.58 45.92,25.15 49.43,21.64 RTC-DS3231.6 | 91.95,35.81 91.34,35.81 88.29,32.77 86,32.77 85.7,33.07 85.09,33.07 84.78,32.77 84.78,32.16 85.55,31.39 86,31.39 86.31,31.09 86.31,30.48 85.24,29.41 81.13,29.41 74.12,36.42 73.51,36.42 67.41,30.33 67.41,26.67 JP3.11
  Bottom 0.152: U$1.P$4 92.71,34.9 98.96,34.9 U$3.P$4 | U$2.P$4 92.71,43.89 98.96,43.89 U$4.P$4 | JP3.11 66.34,26.67 65.28,27.74 64.21,27.74 63.6,27.13 63.6,26.06 60.71,23.16 51.11,23.16 RTC-DS3231.6
SDA
  Top 0.152: 93.47,45.11 98.96,45.11 U$4.P$3 | 93.47,45.11 92.71,45.11 U$2.P$3 | 93.47,45.11 93.47,37.03 92.71,36.27 U$1.P$3 | R2.1 28.55,32.92 32.97,32.92 38.15,27.74 42.42,27.74 43.33,26.82 43.33,25.3 46.99,21.64 RTC-DS3231.5 | JP3.12 70,26.82 87.07,26.82 96.37,36.12 98.96,36.12 U$3.P$3
  Bottom 0.152: U$1.P$3 92.71,36.27 98.96,36.27 U$3.P$3 | JP3.12 68.94,26.67 67.56,28.04 64.06,28.04 63.3,27.28 63.3,26.21 60.55,23.47 48.82,23.47 46.99,21.64 RTC-DS3231.5
SHDN  (via drill 0.33)
  Top 0.152: v54,18.44 62.23,10.21 J5.5
  Bottom 0.152: v54,18.44 17.88,18.44 15.14,21.18 15.14,22.1 10.57,26.67 STEPDOWN-D24V5F3.4
SLA
  Bottom 0.152: AMIS-30543.12 77.47,3.35 75.95,4.88 75.95,9.3 68.17,17.07 64.21,17.07 J4.2
SQW/INT/D6  (via drill 0.33)
  Top 0.152: v89.36,24.23 107.34,24.23 JP2.6 | v86.31,24.23 82.5,24.23 80.21,26.52 71.22,26.52 70.31,25.6 63.3,25.6 JP3.9 | REED1.3 38.15,2.29 38.15,20.27 39.37,21.49 RTC-DS3231.2
  Bottom 0.152: JP3.9 61.32,26.67 60.1,25.45 48.06,25.45 45.47,22.86 40.59,22.86 39.37,21.64 RTC-DS3231.2 | v86.31,24.23 v89.36,24.23
SWITCH-VOUT
  Top 0.152: STEPDOWN-D24V5F3.3 12.7,22.86 BIG-PUSH-B.8 14.07,21.64 16.51,21.64 BIG-PUSH-B.7
  Bottom 0.152: J5.3 67.41,10.06 68.17,10.06 69.24,8.99 70.46,8.99 71.07,9.6 71.07,10.67 66.65,15.09 58.27,15.09 54.3,19.05 18.95,19.05 16.51,21.49 BIG-PUSH-B.7
VBAT
  Top 0.152: JP3.1 41.96,26.67 41.96,25.76 45.77,21.95 45.77,21.03 56.59,10.21 59.64,10.21 J5.6
VBUS
  Top 0.152: JP3.3 50.5,23.16 57.35,23.16 60.71,19.81 60.71,18.9 68.17,11.43 71.07,11.43 72.29,10.21 J5.1
VDD/5V  (via drill 0.33)
  Top 0.152: v111.15,31.09 110.54,31.7 107.49,31.7 JP2.9 | D1.C D2.C D3.C 44.09,41.91 | D4.C 44.09,41.91 | v44.09,30.33 44.09,41.91 | v46.84,25.15 49.12,22.86 55.83,22.86 59.33,19.36 J4.1
  Bottom 0.152: 114.66,19.05 115.72,17.98 115.72,16 114.66,14.94 114.66,14.02 J1.4 114.66,13.87 114.66,13.11 116.03,11.73 116.03,5.18 111.76,0.91 80.06,0.91 78.99,1.98 | v111.15,31.09 112.67,31.09 J1.10 115.72,28.04 115.72,26.06 114.66,24.99 114.66,24.23 J1.8 114.66,24.08 115.72,23.01 115.72,21.03 114.66,19.96 114.66,19.05 | 114.66,19.05 J1.6 | 78.99,1.98 78.08,1.07 76.86,1.07 75.64,2.29 75.64,2.74 75.34,3.05 75.34,8.99 72.9,11.43 72.75,11.43 68.78,15.39 63.75,15.39 59.94,19.2 59.49,19.2 J4.1 | 78.99,1.98 78.99,25.6 77.77,26.82 76.86,26.82 76.25,27.43 76.25,30.94 78.54,33.22 79.91,33.22 J8.1 | v44.09,30.33 44.09,28.65 45.92,26.82 45.92,26.06 v46.84,25.15
VM  (via drill 0.33)
  Top 0.152: v90.58,19.05 JP2.4 | v73.81,35.81 v82.19,27.43 | v59.33,37.19 59.33,39.93 56.44,42.82 R5.2
  Bottom 0.152: v82.19,27.43 v90.58,19.05 | v73.81,35.81 60.71,35.81 v59.33,37.19
VMOT
  Top 0.152: AMIS-1.3 100.33,26.21 105.66,31.55 105.66,39.17 110.85,44.35 114.5,44.35 J1.16

### Text on the board
tPlace: A0 | A1 | S1N | S2N | - | - | VMOT | GND | GND | + | + | GND | D12 | MI | TXP | TINGLY-TENTACLE | ver 0.1 | S4N | MO | TXN | 3VSTEP | D11 | S3N | GND | GND | SCK | TYN | 5V | D24V5F3 | 5V | TYP | 3V3 | 5V | FEATHER | GND | S1N | EXPRESS M0 | VMOT | INT | 5V | 5V | A5 | S2N | SLA | POR | ERR | CLR | DIR | 5V | 5V | VM | S3N | MOTOR | 5V | SWITCH | D1 | RTC | VBAT | SHDN | BAT | SOUT | CTRL | VBUS | D0 | S4N | 2812 | DS3231 | A2 | A3 | B | A | ON | INT | OFF | A3 | 3V3 | GND | | | SLA